# EAGLE design trx-breakout (EAGLE 9.6.2)
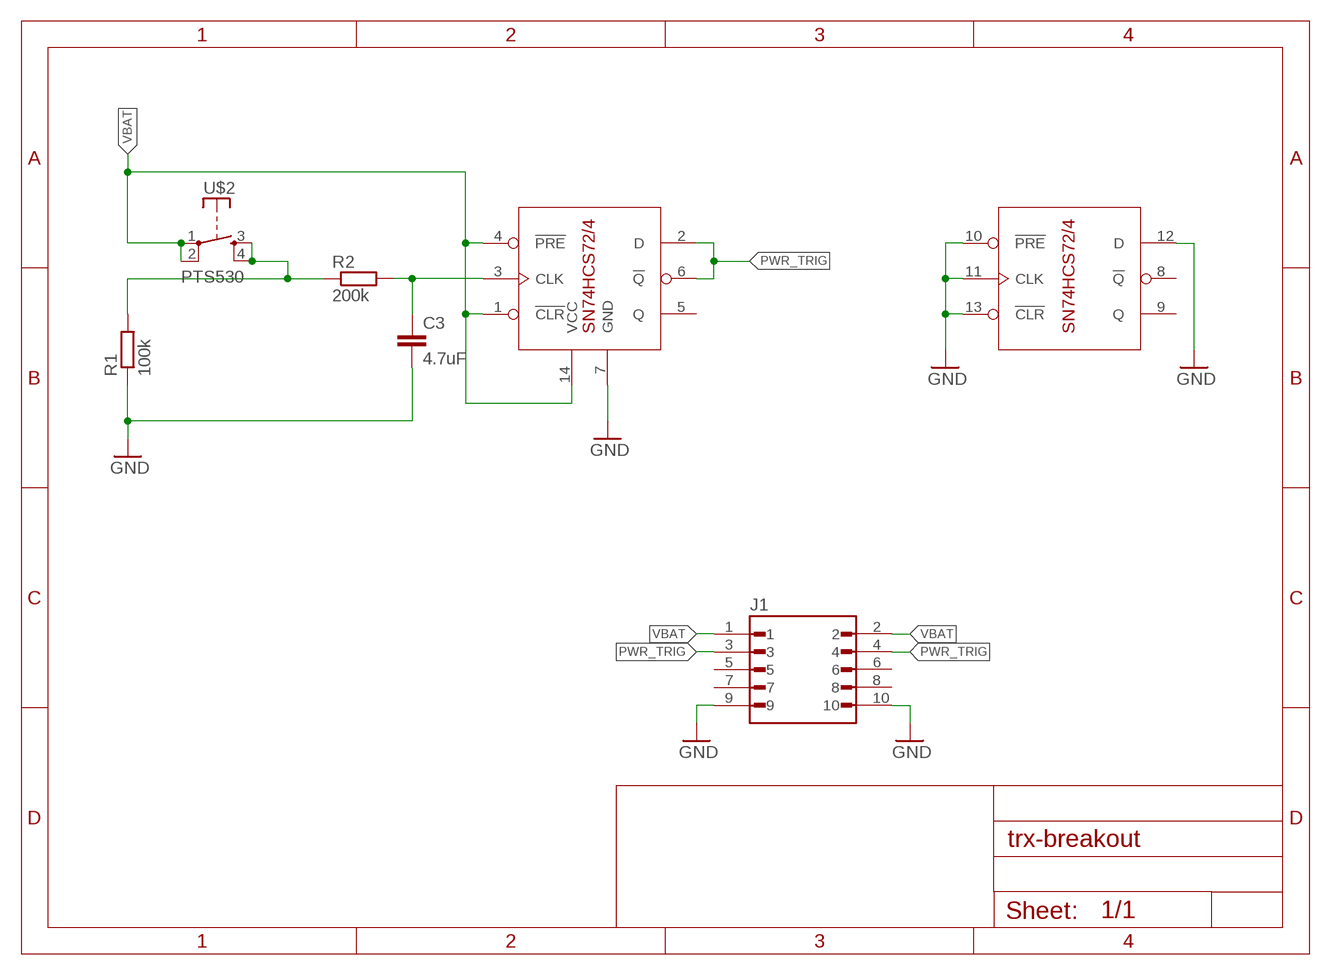
[diagram p0: schematic, sheet 1]

## Parts
C3  4.7uF  C-EUC0805  [C0805]
J1  DF12NB(3.0)-10DX-0.5VHRS_DF12NB(3.0)-10DS-0.5V  [HRS_DF12NB(3.0)-10DS-0.5V]
R1  100k  R-EU_R0805  [R0805]
R2  200k  R-EU_R0805  [R0805]
U$1  SN74HCS72/4  [TSSOP14]
U$2  PTS530  [PTS530]

## Nets
GND: C3.2 J1.9 J1.10 R1.1 U$1.7(SUPPPLY:GND) U$1.10(!PRE) U$1.11(CLK) U$1.12(D) U$1.13(!CLR)
N$3: C3.1 R2.2 U$1.3(CLK)
N$4: R1.2 R2.1 U$2.3(S) U$2.4(S)
PWR_TRIG: J1.3 J1.4 U$1.2(D) U$1.6(!Q)
VBAT: J1.1 J1.2 U$1.1(!CLR) U$1.4(!PRE) U$1.14(SUPPPLY:VCC) U$2.1(P) U$2.2(P)
Unconnected: J1.5 J1.6 J1.7 J1.8 U$1.5(Q) U$1.8(!Q) U$1.9(Q)

## Library data of the parts
C3 = rcl:C-EU: CAPACITOR, European symbol; SPICEPREFIX: C
J1 = con-hirose2:DF12NB(3.0)-10DX-0.5V: Check availability <https://pricing.snapeda.com/parts/DF12NB%283.0%29-10DP-0.5V%2851%29/Hirose/view-part?ref=eda>
R1 R2 = rcl:R-EU_: RESISTOR, European symbol; SPICEPREFIX: R
U$1 = texas-instruments:SN74HCS72/4
U$2 = switches-ck:PTS530

## Board
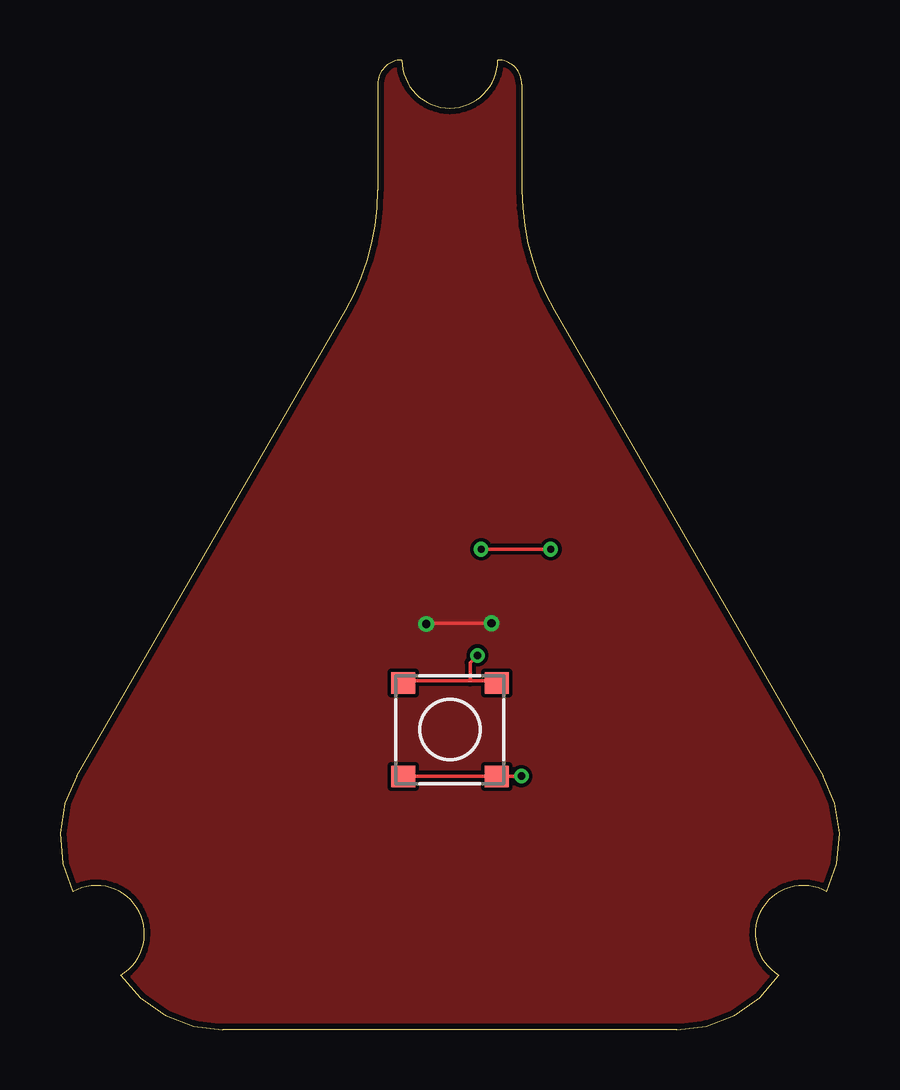
[diagram p1: board, top side]
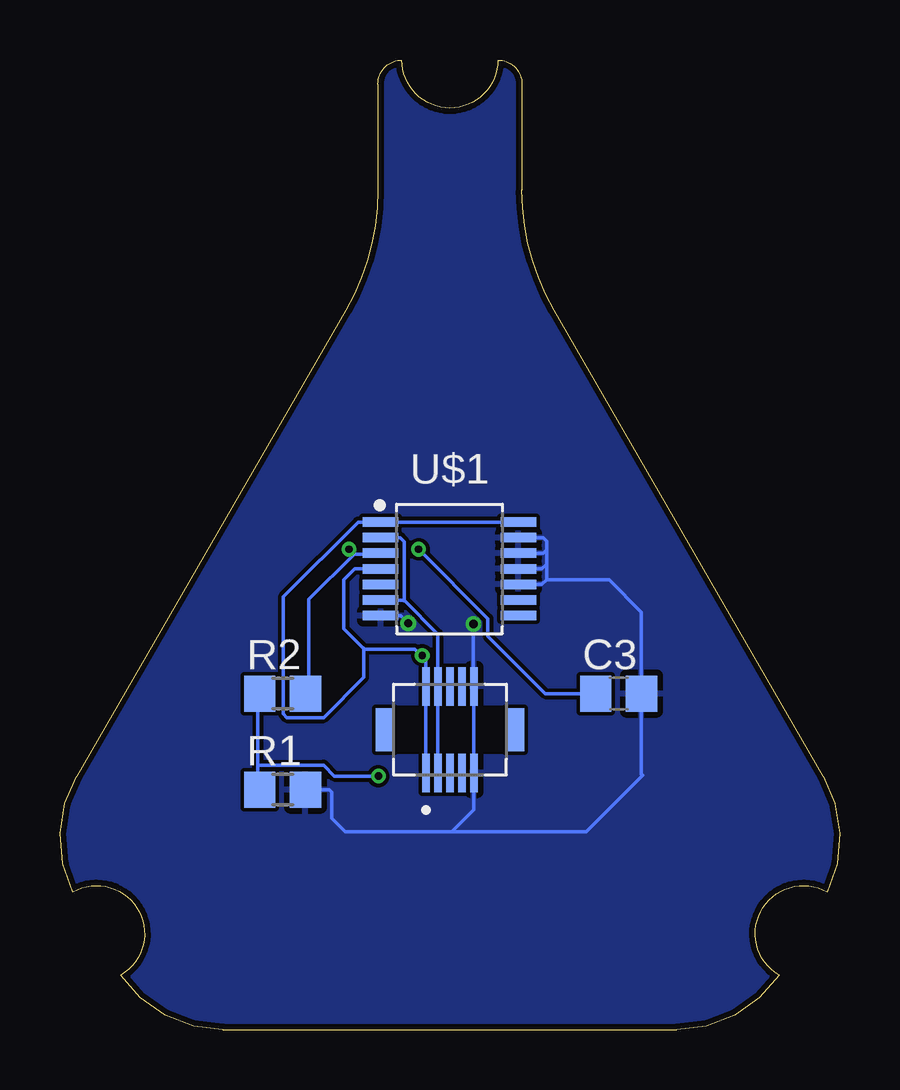
[diagram p2: board, bottom side, seen from below]

Size 32.49 x 40.4 mm. Coordinates in mm from the lower left corner, seen from the top.
Outline: 19.24,39.4 arc90 18.24,40.4 arc-180 14.24,40.4 arc90 13.24,39.4 13.24,34.98 arc-30 11.9,29.98 0.69,10.56 0.21,9.42 0,8.18 0.11,6.91 0.53,5.74 arc-179 2.53,2.27 3.35,1.33 4.38,0.59 5.56,0.14 6.79,0 25.7,0 26.93,0.15 28.11,0.59 29.15,1.33 29.96,2.27 arc-179 31.96,5.74 32.37,6.92 32.49,8.18 32.29,9.43 31.8,10.56 20.58,29.98 arc-30 19.24,34.98 19.24,39.4
Copper layers (1*16): Top 0.035mm / dielectric 1.5mm / Bottom 0.035mm
Design rules "seeed-studio-2-layer (1)": minimum track width 6mil, minimum drill 12mil, track to track 6mil, track to pad 6mil, pad to pad 6mil, via to via 6mil, smd to smd 0mil, copper to edge 10mil, drill to drill 10mil, minimum pad ring 10mil, minimum via ring 6mil, stop-mask expansion 2mil, vias tented up to drill 100mil, thermal gap 10mil

### Footprints (pad centres in the part's own frame; a part is rotated, then mirrored left to right if it is on the bottom)
C0805 = smd 1.3 x 1.5: 1 -0.95,0; 2 0.95,0
HRS_DF12NB(3.0)-10DS-0.5V = smd 0.3 x 1.6: 1 -1,-1.8; 2 -1,1.8; 3 -0.5,-1.8; 4 -0.5,1.8; 5 0,-1.8; 6 0,1.8; 7 0.5,-1.8; 8 0.5,1.8; 9 1,-1.8; 10 1,1.8 | smd 0.8 x 1.8: S1 -2.7,0; S2 2.7,0
R0805 = smd 1.3 x 1.5: 1 -0.95,0; 2 0.95,0
TSSOP14 = smd 1.469 x 0.392: 1 -2.871,1.95; 2 -2.871,1.3; 3 -2.871,0.65; 4 -2.871,0; 5 -2.871,-0.65; 6 -2.871,-1.3; 7 -2.871,-1.95; 8 2.871,-1.95; 9 2.871,-1.3; 10 2.871,-0.65; 11 2.871,0; 12 2.871,0.65; 13 2.871,1.3; 14 2.871,1.95
PTS530 = smd 1 x 0.9: 1 -1.95,1.95; 2 1.95,1.95; 3 1.95,-1.95; 4 -1.95,-1.95

### Placement (x,y rotation side)
C3  9.21,14 0 bottom
J1  16.24,12.5 0 bottom
R1  23.21,10 180 bottom
R2  23.21,14 0 bottom
U$1  16.26,19.2 0 bottom
U$2  16.24,12.5 0 top

### Tracks (layer width: path | path; a pad name or v marks a point on that pad's centre or on a via)
GND  (via drill 0.35)
  Top 0.152: v17.98,16.93 15.29,16.93 v15.26,16.9
  Bottom 0.152: U$1.13 12.36,20.5 12.21,20.35 12.21,20 | 12.21,20 12.36,19.85 U$1.12 | U$1.11 12.41,19.2 12.21,19.4 | 12.21,19.4 12.21,20 | U$1.10 12.41,18.55 12.21,18.75 | 12.21,18.75 12.21,19.4 | 12.21,18.75 9.61,18.75 8.26,17.4 C3.2 8.26,10.65 8.21,10.6 10.56,8.25 16.16,8.25 | R1.1 21.26,10 21.16,9.9 21.16,8.8 20.61,8.25 16.16,8.25 | 16.16,8.25 15.24,9.17 J1.9 J1.10 15.26,14.32 v15.26,16.9 | U$1.7 18.3,17.25 v17.98,16.93
  pour Bottom: -6.29,13.73 10.32,42.5 22.71,42.5 41.81,9.41 36.07,-0.53 1.94,-0.53
  pour Top: -6.76,13.93 9.74,42.5 22.88,42.5 41.45,10.32 35.12,-0.65 1.66,-0.65
N$3  (via drill 0.3)
  Top 0.152: v20.44,20.01 v17.55,20.01
  Bottom 0.152: 20.24,19.81 19.16,19.81 U$1.3 | 20.24,19.81 22.12,17.93 22.12,14.07 R2.2 | 20.24,19.81 v20.44,20.01 | v17.55,20.01 14.66,17.13 14.66,16.4 12.26,14 C3.1
N$4  (via drill 0.3)
  Top 0.152: U$2.4 14.35,10.56 18.16,10.56 U$2.3 18.31,10.56 v19.22,10.56
  Bottom 0.152: 24.25,11.02 24.25,13.92 R2.1 | 24.25,11.02 24.25,10.11 R1.2 | v19.22,10.56 21.05,10.56 21.51,11.02 24.25,11.02
PWR_TRIG
  Bottom 0.152: U$1.6 18.16,17.9 18.15,17.89 | 18.15,17.89 16.74,16.48 J1.4 J1.3 | 18.16,17.88 18.15,17.89 | U$1.2 18.31,20.5 18.15,20.34 18.15,17.89
VBAT  (via drill 0.3)
  Top 0.152: 17.09,14.53 18.16,14.53 U$2.2 | 17.09,14.53 14.35,14.53 U$2.1 | 17.09,14.53 17.09,15.29 v17.4,15.59
  Bottom 0.152: U$1.14 U$1.1 20.07,21.15 23.19,18.03 23.19,13.15 23.03,13 21.51,13 19.83,14.68 19.83,15.9 19.81,15.85 | J1.1 J1.2 17.24,15.38 17.43,15.56 | U$1.4 20.21,19.2 20.66,18.75 20.66,16.7 19.81,15.85 | 17.43,15.56 17.71,15.85 19.81,15.85 | v17.4,15.59 17.43,15.56